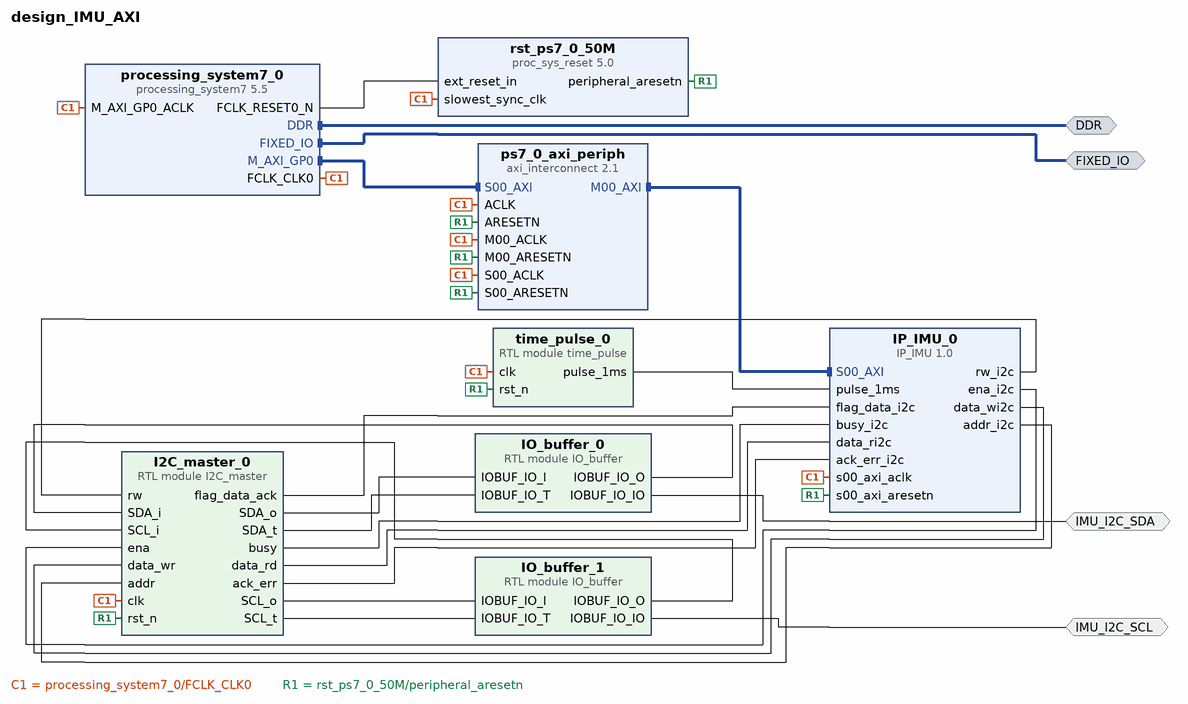
[diagram p0: block diagram of the top level]
# Vivado block design design_IMU_AXI, xc7z020clg400-1, Vivado 2020.2
create_bd_design design_IMU_AXI

create_bd_intf_port -mode Master -vlnv xilinx.com:interface:ddrx_rtl:1.0 DDR
create_bd_intf_port -mode Master -vlnv xilinx.com:display_processing_system7:fixedio_rtl:1.0 FIXED_IO
create_bd_port -dir IO IMU_I2C_SDA
create_bd_port -dir IO IMU_I2C_SCL

create_bd_cell -type ip -vlnv xilinx.com:ip:processing_system7:5.5 processing_system7_0
set_property -dict [list \
  CONFIG.PCW_APU_PERIPHERAL_FREQMHZ 667 \
  CONFIG.PCW_ENET0_ENET0_IO {MIO 16 .. 27} \
  CONFIG.PCW_ENET0_GRP_MDIO_ENABLE 1 \
  CONFIG.PCW_ENET0_GRP_MDIO_IO {MIO 52 .. 53} \
  CONFIG.PCW_ENET0_PERIPHERAL_ENABLE 1 \
  CONFIG.PCW_ENET0_RESET_ENABLE 0 \
  CONFIG.PCW_ENET_RESET_ENABLE 1 \
  CONFIG.PCW_ENET_RESET_SELECT {Share reset pin} \
  CONFIG.PCW_GPIO_MIO_GPIO_ENABLE 1 \
  CONFIG.PCW_GPIO_MIO_GPIO_IO MIO \
  CONFIG.PCW_I2C_RESET_ENABLE 1 \
  CONFIG.PCW_PRESET_BANK1_VOLTAGE {LVCMOS 1.8V} \
  CONFIG.PCW_QSPI_GRP_FBCLK_ENABLE 1 \
  CONFIG.PCW_QSPI_GRP_FBCLK_IO {MIO 8} \
  CONFIG.PCW_QSPI_GRP_SINGLE_SS_ENABLE 1 \
  CONFIG.PCW_QSPI_GRP_SINGLE_SS_IO {MIO 1 .. 6} \
  CONFIG.PCW_QSPI_PERIPHERAL_ENABLE 1 \
  CONFIG.PCW_QSPI_QSPI_IO {MIO 1 .. 6} \
  CONFIG.PCW_SD0_GRP_CD_ENABLE 1 \
  CONFIG.PCW_SD0_GRP_CD_IO {MIO 47} \
  CONFIG.PCW_SD0_GRP_WP_ENABLE 0 \
  CONFIG.PCW_SD0_PERIPHERAL_ENABLE 1 \
  CONFIG.PCW_SD0_SD0_IO {MIO 40 .. 45} \
  CONFIG.PCW_SDIO_PERIPHERAL_FREQMHZ 50 \
  CONFIG.PCW_SINGLE_QSPI_DATA_MODE x4 \
  CONFIG.PCW_UART1_PERIPHERAL_ENABLE 1 \
  CONFIG.PCW_UART1_UART1_IO {MIO 48 .. 49} \
  CONFIG.PCW_UART_PERIPHERAL_FREQMHZ 100 \
  CONFIG.PCW_UIPARAM_DDR_FREQ_MHZ 533.333333 \
  CONFIG.PCW_UIPARAM_DDR_MEMORY_TYPE {DDR 3 (Low Voltage)} \
  CONFIG.PCW_UIPARAM_DDR_PARTNO {MT41K256M16 RE-125} \
  CONFIG.PCW_USB0_PERIPHERAL_ENABLE 1 \
  CONFIG.PCW_USB0_RESET_ENABLE 1 \
  CONFIG.PCW_USB0_RESET_IO {MIO 46} \
  CONFIG.PCW_USB0_USB0_IO {MIO 28 .. 39} \
  CONFIG.PCW_USB_RESET_ENABLE 1 \
  CONFIG.PCW_USB_RESET_SELECT {Share reset pin} \
] [get_bd_cells processing_system7_0]
# 296 more settings of processing_system7_0 are not shown: defaults, MIO pin electricals, DDR timing, and values the tool derives
create_bd_cell -type ip -vlnv xilinx.com:ip:axi_interconnect:2.1 ps7_0_axi_periph
set_property -dict {CONFIG.NUM_MI 1} [get_bd_cells ps7_0_axi_periph]
create_bd_cell -type ip -vlnv xilinx.com:ip:proc_sys_reset:5.0 rst_ps7_0_50M
create_bd_cell -type module -reference IO_buffer IO_buffer_0
create_bd_cell -type module -reference time_pulse time_pulse_0
set_property -dict {CONFIG.freq_clk_MHz 50} [get_bd_cells time_pulse_0]
create_bd_cell -type module -reference I2C_master I2C_master_0
set_property -dict {CONFIG.input_clk 50000000} [get_bd_cells I2C_master_0]
create_bd_cell -type module -reference IO_buffer IO_buffer_1
create_bd_cell -type ip -vlnv elsys-design.com:user:IP_IMU:1.0 IP_IMU_0

# ---- connections ----

connect_bd_intf_net [get_bd_intf_ports DDR] [get_bd_intf_pins processing_system7_0/DDR]
connect_bd_intf_net [get_bd_intf_ports FIXED_IO] [get_bd_intf_pins processing_system7_0/FIXED_IO]
connect_bd_intf_net [get_bd_intf_pins ps7_0_axi_periph/M00_AXI] [get_bd_intf_pins IP_IMU_0/S00_AXI]
connect_bd_intf_net [get_bd_intf_pins processing_system7_0/M_AXI_GP0] [get_bd_intf_pins ps7_0_axi_periph/S00_AXI]
connect_bd_net [get_bd_pins processing_system7_0/FCLK_CLK0] \
  [get_bd_pins processing_system7_0/M_AXI_GP0_ACLK] [get_bd_pins ps7_0_axi_periph/S00_ACLK] \
  [get_bd_pins rst_ps7_0_50M/slowest_sync_clk] [get_bd_pins ps7_0_axi_periph/M00_ACLK] [get_bd_pins ps7_0_axi_periph/ACLK] \
  [get_bd_pins I2C_master_0/clk] [get_bd_pins time_pulse_0/clk] [get_bd_pins IP_IMU_0/s00_axi_aclk]
connect_bd_net [get_bd_pins processing_system7_0/FCLK_RESET0_N] [get_bd_pins rst_ps7_0_50M/ext_reset_in]
connect_bd_net [get_bd_pins rst_ps7_0_50M/peripheral_aresetn] \
  [get_bd_pins ps7_0_axi_periph/S00_ARESETN] [get_bd_pins ps7_0_axi_periph/M00_ARESETN] \
  [get_bd_pins ps7_0_axi_periph/ARESETN] [get_bd_pins I2C_master_0/rst_n] [get_bd_pins time_pulse_0/rst_n] \
  [get_bd_pins IP_IMU_0/s00_axi_aresetn]
connect_bd_net [get_bd_pins I2C_master_0/SDA_o] [get_bd_pins IO_buffer_0/IOBUF_IO_I]
connect_bd_net [get_bd_pins I2C_master_0/SDA_t] [get_bd_pins IO_buffer_0/IOBUF_IO_T]
connect_bd_net [get_bd_pins I2C_master_0/SCL_o] [get_bd_pins IO_buffer_1/IOBUF_IO_I]
connect_bd_net [get_bd_pins I2C_master_0/SCL_t] [get_bd_pins IO_buffer_1/IOBUF_IO_T]
connect_bd_net [get_bd_pins IO_buffer_1/IOBUF_IO_O] [get_bd_pins I2C_master_0/SCL_i]
connect_bd_net [get_bd_pins IO_buffer_0/IOBUF_IO_O] [get_bd_pins I2C_master_0/SDA_i]
connect_bd_net [get_bd_ports IMU_I2C_SDA] [get_bd_pins IO_buffer_0/IOBUF_IO_IO]
connect_bd_net [get_bd_ports IMU_I2C_SCL] [get_bd_pins IO_buffer_1/IOBUF_IO_IO]
connect_bd_net [get_bd_pins IP_IMU_0/rw_i2c] [get_bd_pins I2C_master_0/rw]
connect_bd_net [get_bd_pins time_pulse_0/pulse_1ms] [get_bd_pins IP_IMU_0/pulse_1ms]
connect_bd_net [get_bd_pins I2C_master_0/flag_data_ack] [get_bd_pins IP_IMU_0/flag_data_i2c]
connect_bd_net [get_bd_pins I2C_master_0/busy] [get_bd_pins IP_IMU_0/busy_i2c]
connect_bd_net [get_bd_pins IP_IMU_0/ena_i2c] [get_bd_pins I2C_master_0/ena]
connect_bd_net [get_bd_pins IP_IMU_0/data_wi2c] [get_bd_pins I2C_master_0/data_wr]
connect_bd_net [get_bd_pins IP_IMU_0/addr_i2c] [get_bd_pins I2C_master_0/addr]
connect_bd_net [get_bd_pins I2C_master_0/data_rd] [get_bd_pins IP_IMU_0/data_ri2c]
connect_bd_net [get_bd_pins I2C_master_0/ack_err] [get_bd_pins IP_IMU_0/ack_err_i2c]

# ---- address map ----
assign_bd_address -offset 0x43C00000 -range 64K -target_address_space [get_bd_addr_spaces processing_system7_0/Data] [get_bd_addr_segs IP_IMU_0/S00_AXI/S00_AXI_reg]

validate_bd_design
save_bd_design
